# Altium schematic sheet MQTT_ESP_Scheme.SchDoc: =GlobalProjectName
size 410 x 297 mm; Scale: 1:1; Title2str: Название устройства; DocumentType: Схема электрическая принципиальная; FirstReferrence: ХХХ.ХХХХХХ.ХХХ; ApprovedBy: Утвердил; CheckedBy: Проверил; Author: Разработал; Organization: Организация; DocumentNumber: XXX.XX.XX.XXX Э3; SheetNumber: 1; SheetTotal: 2; PageSetup: Record=PageOptions|CenterHorizontal=True|CenterVertical=True|PrintScale=1.00|XCorrection=1.00|YCorrection=1.00|PrintKind=1|BorderSize=5000000|LeftOffset=0|BottomOffset=0|Orientation=2|PaperLength=1000|PaperWidth=1000|Scale=100|PaperSource=15|PrintQuality=1200|MediaType=1|DitherType=10|PaperKind=A3|PrintScaleMode=1; Weight: -; ScaleFactor: -; NormInspection: Норм.Контр.; ProcessInspection: Т.контр.; FirstApplication: XXX.XX.XX.XXX; DeviceName: Название устройства; SchemeType: Тип схемы; GlobalProjectNumber: XXX.XX.XX.XXX
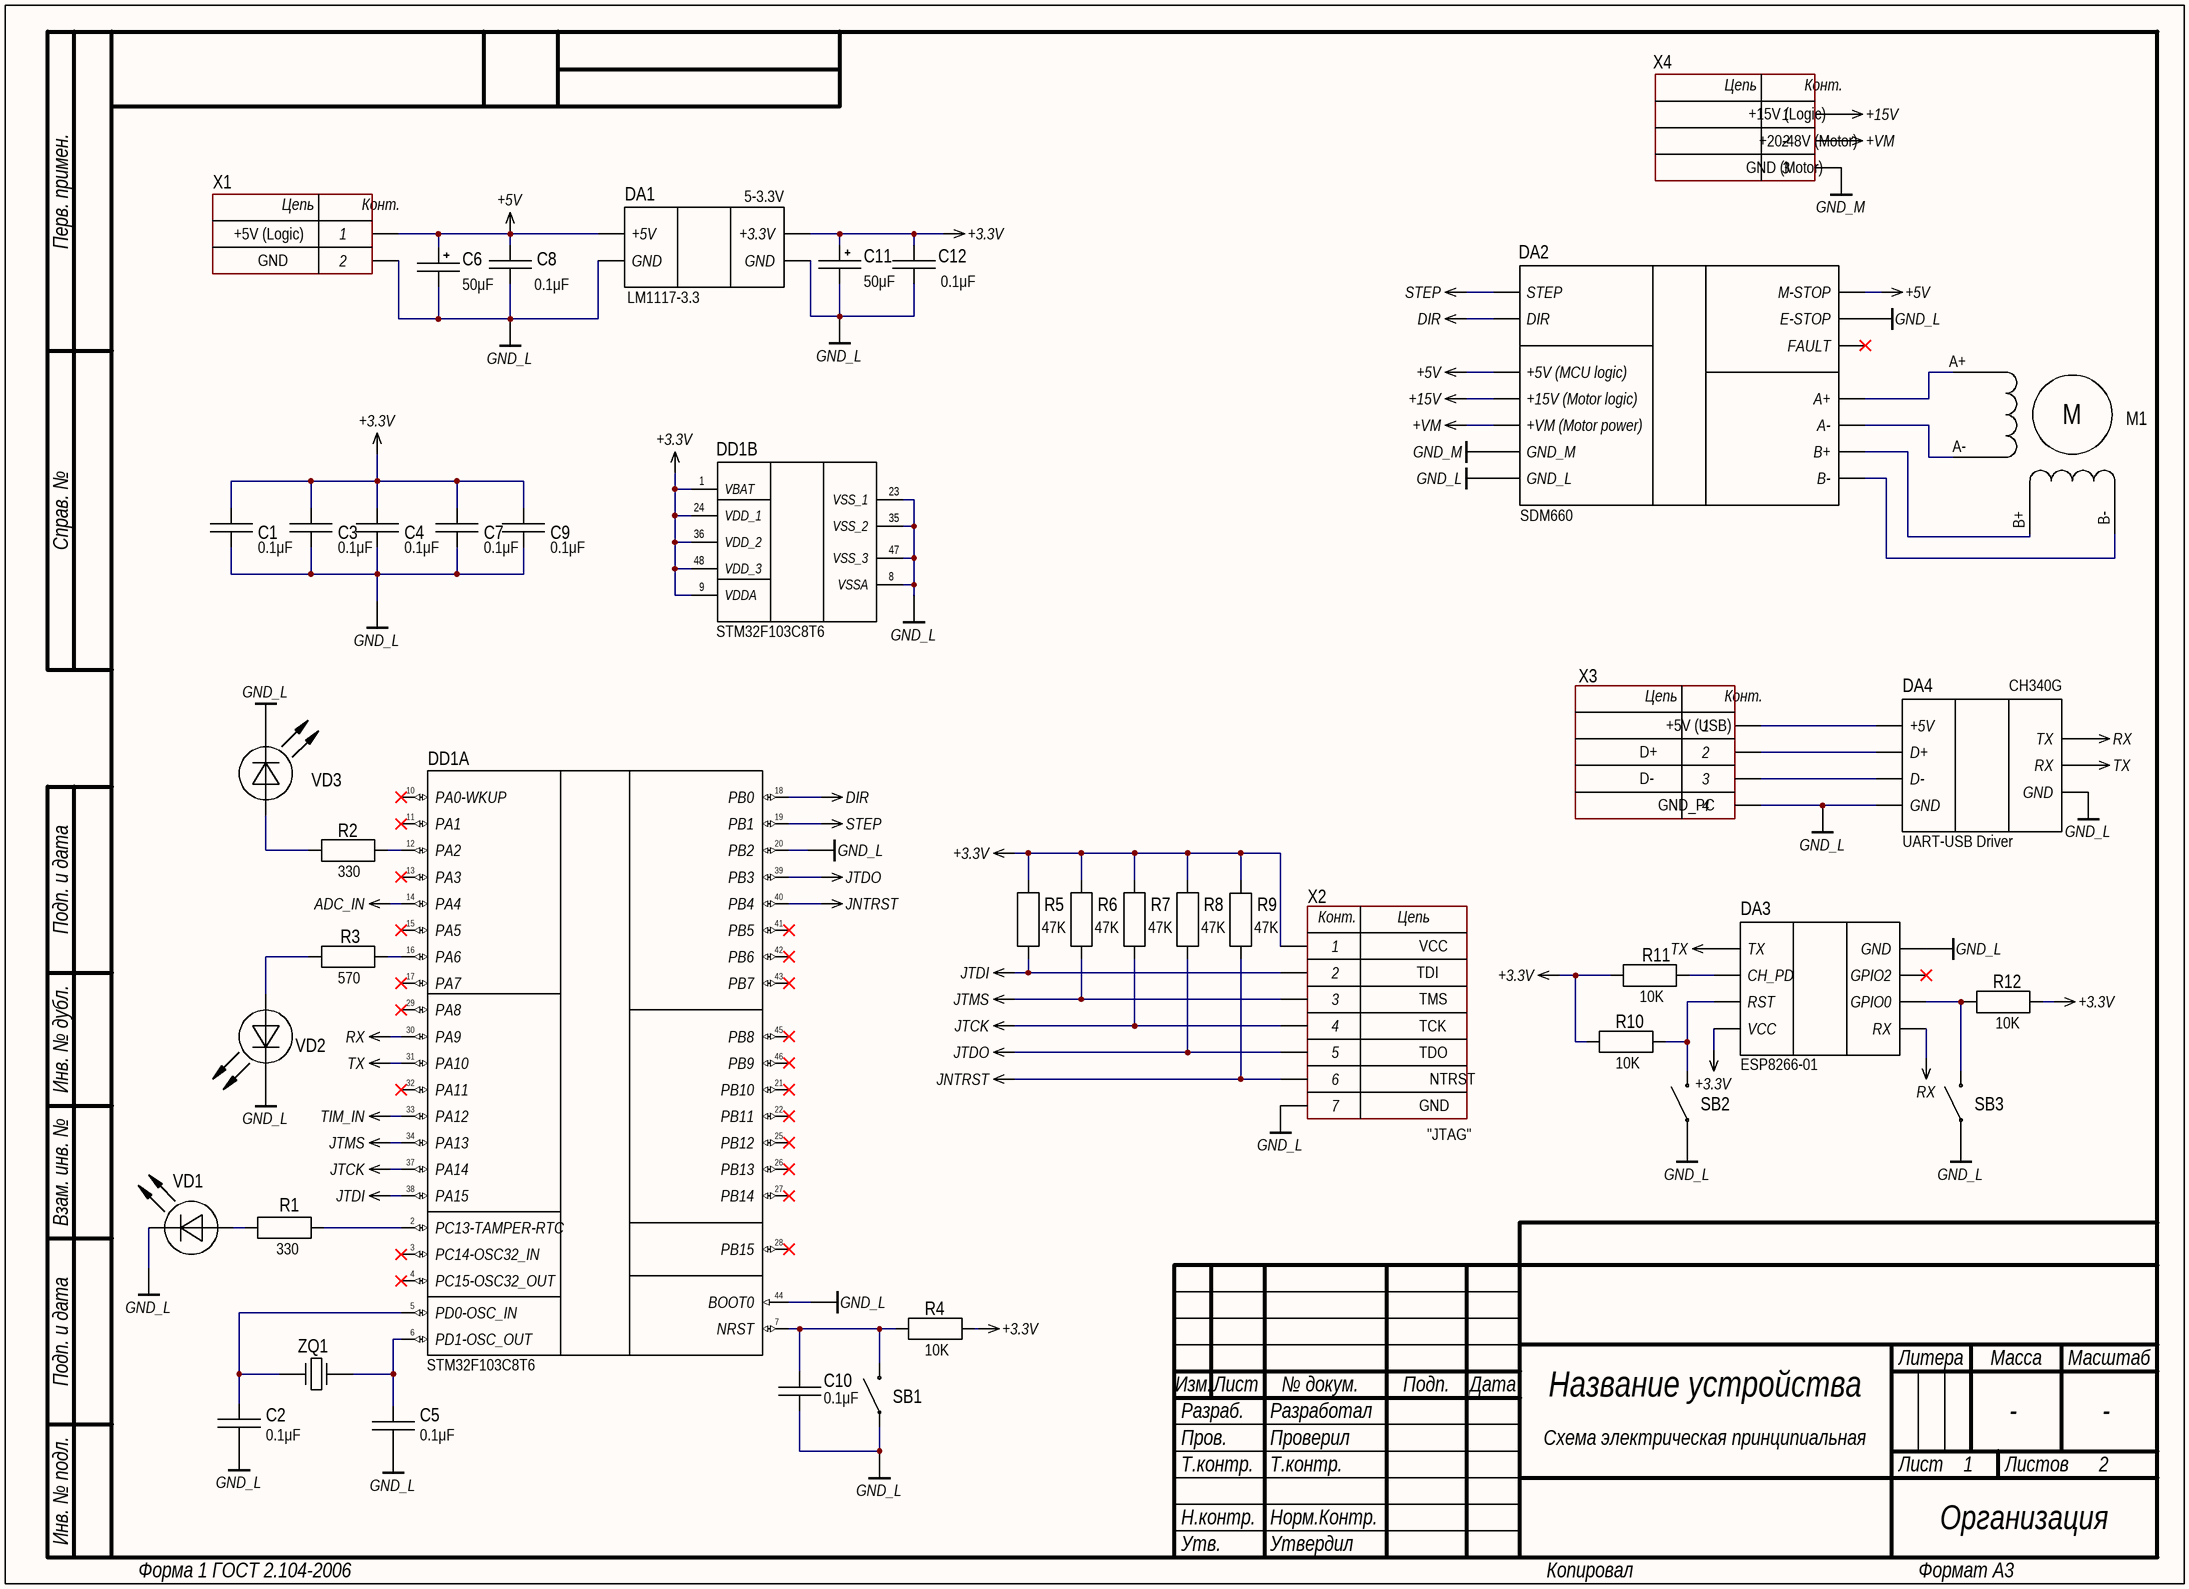
[diagram p0: MQTT_ESP_Scheme.SchDoc]

## Parts
C1  value 0.1μF  [CAPASITOR 1206]
C2  value 0.1μF  [CAPASITOR 1206]
C3  value 0.1μF  [CAPASITOR 1206]
C4  value 0.1μF  [CAPASITOR 1206]
C5  value 0.1μF  [CAPASITOR 1206]
C6  value 50μF  [CAP ALSMD POLY 8.3MM H10.0MM]
C7  value 0.1μF  [CAPASITOR 1206]
C8  value 0.1μF  [CAPASITOR 1206]
C9  value 0.1μF  [CAPASITOR 1206]
C10  value 0.1μF  [CAPASITOR 1206]
C11  value 50μF  [CAP ALSMD POLY 8.3MM H10.0MM]
C12  value 0.1μF  [CAPASITOR 1206]
DA1  5-3.3V
DA2  SDM660
DA3  ESP8266-01
DA4  UART-USB Driver
DD1  STM32F103C8T6  (parts A,B of 2)
M1  Stepper Motor  (value not drawn)
R1  value 330  [RESISTOR 1206]
R2  value 330  [RESISTOR 1206]
R3  value 570  [RESISTOR 1206]
R4  value 10K  [RESISTOR 1206]
R5  value 47K  [RESISTOR 1206]
R6  value 47K  [RESISTOR 1206]
R7  value 47K  [RESISTOR 1206]
R8  value 47K  [RESISTOR 1206]
R9  value 47K  [RESISTOR 1206]
R10  value 10K  [RESISTOR 1206]
R11  value 10K  [RESISTOR 1206]
R12  value 10K  [RESISTOR 1206]
SB1  Button  (value not drawn)
SB2  Button  (value not drawn)
SB3  Button  (value not drawn)
VD1  (no value)  [LED]
VD2  (no value)  [LED]
VD3  (no value)  [LED]
X1  (no value)  [CON: 6PCV-03-006]
X2  (no value)
X3  (no value)  [CON: 6PCV-03-006]
X4  (no value)  [CON: 6PCV-03-006]
ZQ1  Кварц  (value not drawn)

## Nets
+3.3V: C1.2 C3.2 C4.2 C7.2 C9.2 C11.1 C12.2 DA1.3(+3.3V) DA3.4(VCC) DD1.1(VBAT) DD1.9(VDDA) DD1.24(VDD_1) DD1.36(VDD_2) DD1.48(VDD_3) R4.2 R5.2 R6.2 R7.2 R8.2 R9.2 R10.1 R11.1 R12.2 X2.1
+5V: C6.1 C8.2 DA1.1(+5V) DA2.3(M-STOP) X1.1
+15V: DA2.3(+15V_(Motor_logic)) X4.1
+VM: DA2.3(+VM_(Motor_power)) X4.2
ADC_IN: DD1.14(PA4)
DIR: DA2.3(DIR) DD1.18(PB0)
GND_L: C1.1 C2.1 C3.1 C4.1 C5.1 C6.2 C7.1 C8.1 C9.1 C10.1 C11.2 C12.1 DA1.2(GND) DA1.4(GND) DA2.3(E-STOP) DA3.5(GND) DA4.3(GND) DA4.8(GND) DD1.8(VSSA) DD1.20(PB2) DD1.23(VSS_1) DD1.35(VSS_2) DD1.44(BOOT0) DD1.47(VSS_3) SB1.1 SB2.1 SB3.1 VD1.2(C) VD2.2(C) VD3.2(C) X1.2 X2.7 X3.4
GND_M: DA2.3(GND_M) X4.3
JNTRST: DD1.40(PB4) R9.1 X2.6
JTCK: DD1.37(PA14) R7.1 X2.4
JTDI: DD1.38(PA15) R5.1 X2.2
JTDO: DD1.39(PB3) R8.1 X2.5
JTMS: DD1.34(PA13) R6.1 X2.3
RX: DA3.8(RX) DA4.1(TX) DD1.30(PA9)
STEP: DA2.3(STEP) DD1.19(PB1)
TIM_IN: DD1.33(PA12)
TX: DA3.1(TX) DA4.2(RX) DD1.31(PA10)
NetC2_2: C2.2 DD1.5(PD0-OSC_IN) ZQ1.2
NetC5_2: C5.2 DD1.6(PD1-OSC_OUT) ZQ1.1
NetC10_2: C10.2 DD1.7(NRST) R4.1 SB1.2
NetDA2_3: DA2.3(B-) M1.B-
NetDA2_3: DA2.3(B+) M1.B+  [a separate net that carries the same name]
NetDA2_3: DA2.3(A-) M1.A-  [a separate net that carries the same name]
NetDA2_3: DA2.3(A+) M1.A+  [a separate net that carries the same name]
NetDA3_2: DA3.2(CH_PD) R11.2
NetDA3_3: DA3.3(RST) R10.2 SB2.2
NetDA3_7: DA3.7(GPIO0) R12.1 SB3.2
NetDA4_5: DA4.5(+5V) X3.1
NetDA4_6: DA4.6(D+) X3.2
NetDA4_7: DA4.7(D-) X3.3
NetDD1_2: DD1.2(PC13-TAMPER-RTC) R1.2
NetDD1_12: DD1.12(PA2) R2.2
NetDD1_16: DD1.16(PA6) R3.2
NetR1_1: R1.1 VD1.1(A)
NetR2_1: R2.1 VD3.1(A)
NetR3_1: R3.1 VD2.1(A)

Not connected (* = marked no-connect by the designer): DA3 6(GPIO2)*; DD1 3(PC14-OSC32_IN)* 4(PC15-OSC32_OUT)* 10(PA0-WKUP)* 11(PA1)* 13(PA3)* 15(PA5)* 17(PA7)* 21(PB10)* 22(PB11)* 25(PB12)* 26(PB13)* 27(PB14)* 28(PB15)* 29(PA8)* 32(PA11)* 41(PB5)* 42(PB6)* 43(PB7)* 45(PB8)* 46(PB9)*

## Notes on the sheet
- +15V (Logic)
- GND (Motor)
- +20-48V (Motor)
- (near X1) +5V (Logic)
- GND
- (near DA1) LM1117-3.3
- +5V (USB)
- (near DA4) CH340G
- D+
- D-
- GND_PC
- TDI
- TMS
- VCC
- TDO
- TCK
- NTRST
- "JTAG"
- Название устройства
- Схема электрическая принципиальная
- Перв. примен.
- Справ. №
- Подп. и дата
- Инв. № дубл.
- Взам. инв. №
- Разраб.
- Изм.
- Лист
- № докум.
- Подп.
- Дата
- Литера
- Масса
- Масштаб
- Пров.
- Т.контр.
- Листов
- Инв. № подл.
- Н.контр.
- Утв.
- Форма 1 ГОСТ 2.104-2006
- Копировал
- Формат А3
- (in symbol CONNECTOR 2 PIN) Цепь; Конт.
- (in symbol CONNECTOR 3 PIN) Цепь; Конт.
- (in symbol CONNECTOR 4 PIN) Цепь; Конт.
- (in symbol CONNECTOR 7 PIN) Конт.; Цепь
- (in symbol Stepper Motor) M

## Library data of the parts
C1-C5 C7-C10 C12 = CAPASITOR: Manufacturer: Yageo; PartNumber: CC1206KRX7R9BB104; ValueManufacturerPartNumber: Ceramic capacitor, 0.1μF, X7R, ±10%, 25V, 1206, -55...+125°C; TypeCapacitor: Ceramic capacitor; Tolerance: ±10%; TypeDielectric: X7R; Voltage: 25V; Package: 1206; HelpURL: https://www.digikey.com/product-detail/en/yageo/CC1206KRX7R9BB104/311-1179-1-ND/303089; Temperature: -55...+125°C
C6 C11 = Polar capasitor: Manufacturer: Wurth; PartNumber: 860080475013; ValueManufacturerPartNumber: Aluminium capacitor, 50μF, 25V, ±20%, 54mOhm, 14x10x5 mm, -55...+105°C; TypeCapacitor: Aluminium capacitor; Tolerance: ±20%; Impedance: 54mOhm; Voltage: 25V; Package: 14x10x5 mm; HelpURL: https://www.digikey.com/product-detail/en/wurth-electronics-inc/860080475013/732-9029-1-ND/5728972; Temperature: -55...+105°C
R1 R2 = RESISTOR: Manufacturer: Yageo; PartNumber: RC1206JR-07100RL; ValueManufacturerPartNumber: Resistor film, 330, ±5%, 1206, 0.25W, -55...+125°C; TypeResistor: Resistor film; Power: 0.25W; Tolerance: ±5%; Package: 1206; HelpURL: https://www.digikey.com/product-detail/en/yageo/RC1206JR-07100RL/311-100ERCT-ND/732153; Temperature: -55...+125°C
R3 = RESISTOR: Manufacturer: Yageo; PartNumber: RC1206JR-07100RL; ValueManufacturerPartNumber: Resistor film, 570, ±5%, 1206, 0.25W, -55...+125°C; TypeResistor: Resistor film; Power: 0.25W; Tolerance: ±5%; Package: 1206; HelpURL: https://www.digikey.com/product-detail/en/yageo/RC1206JR-07100RL/311-100ERCT-ND/732153; Temperature: -55...+125°C
R4 R10-R12 = RESISTOR: Manufacturer: Yageo; PartNumber: RC1206JR-07100RL; ValueManufacturerPartNumber: Resistor film, 10K, ±5%, 1206, 0.25W, -55...+125°C; TypeResistor: Resistor film; Power: 0.25W; Tolerance: ±5%; Package: 1206; HelpURL: https://www.digikey.com/product-detail/en/yageo/RC1206JR-07100RL/311-100ERCT-ND/732153; Temperature: -55...+125°C
R5-R9 = RESISTOR: Manufacturer: Yageo; PartNumber: RC1206JR-07100RL; ValueManufacturerPartNumber: Resistor film, 47K, ±5%, 1206, 0.25W, -55...+125°C; TypeResistor: Resistor film; Power: 0.25W; Tolerance: ±5%; Package: 1206; HelpURL: https://www.digikey.com/product-detail/en/yageo/RC1206JR-07100RL/311-100ERCT-ND/732153; Temperature: -55...+125°C
VD1-VD3 = LED_single: ValueManufacturerPartNumber: LED, Green, *, *, *, -55...+150°C; ColorParameter: Green; Manufacturer: *; Package: *; HelpURL: *; Temperature: -55...+150°C; TypeDiode: LED; Current: *; VoltageDrop: *; PartNumber: *; Color: GREEN
X1 = CONNECTOR 2 PIN: Manufacturer: Degson; ValueManufacturerPartNumber: Terminal connector, 2pin, 3.5mm, 300VAC, 10A; PartNumber: DG350-3.5-02P-14; TypeConnector: Terminal connector; VoltageMax: 300VAC; Pitch: 3.5mm; CurrentMax: 10A; Multichannel: 2pin; CommentText: "Разъем"; HelpURL: https://www.chipdip.ru/product/dg350-3.5-02p-12
X2 = CONNECTOR 7 PIN: Manufacturer: Degson; ValueManufacturerPartNumber: Terminal connector, 2pin, 3.5mm, 300VAC, 10A; PartNumber: DG350-3.5-02P-14; TypeConnector: Terminal connector; VoltageMax: 300VAC; Pitch: 3.5mm; CurrentMax: 10A; Multichannel: 2pin; CommentText: "Разъем"; HelpURL: https://www.chipdip.ru/product/dg350-3.5-02p-12
X3 = CONNECTOR 4 PIN: Manufacturer: Degson; ValueManufacturerPartNumber: Terminal connector, 2pin, 3.5mm, 300VAC, 10A; PartNumber: DG350-3.5-02P-14; TypeConnector: Terminal connector; VoltageMax: 300VAC; Pitch: 3.5mm; CurrentMax: 10A; Multichannel: 2pin; CommentText: "Разъем"; HelpURL: https://www.chipdip.ru/product/dg350-3.5-02p-12
X4 = CONNECTOR 3 PIN: Manufacturer: Degson; ValueManufacturerPartNumber: Terminal connector, 2pin, 3.5mm, 300VAC, 10A; PartNumber: DG350-3.5-02P-14; TypeConnector: Terminal connector; VoltageMax: 300VAC; Pitch: 3.5mm; CurrentMax: 10A; Multichannel: 2pin; CommentText: "Разъем"; HelpURL: https://www.chipdip.ru/product/dg350-3.5-02p-12